# EAGLE schematic Node (EAGLE 9.1.3)
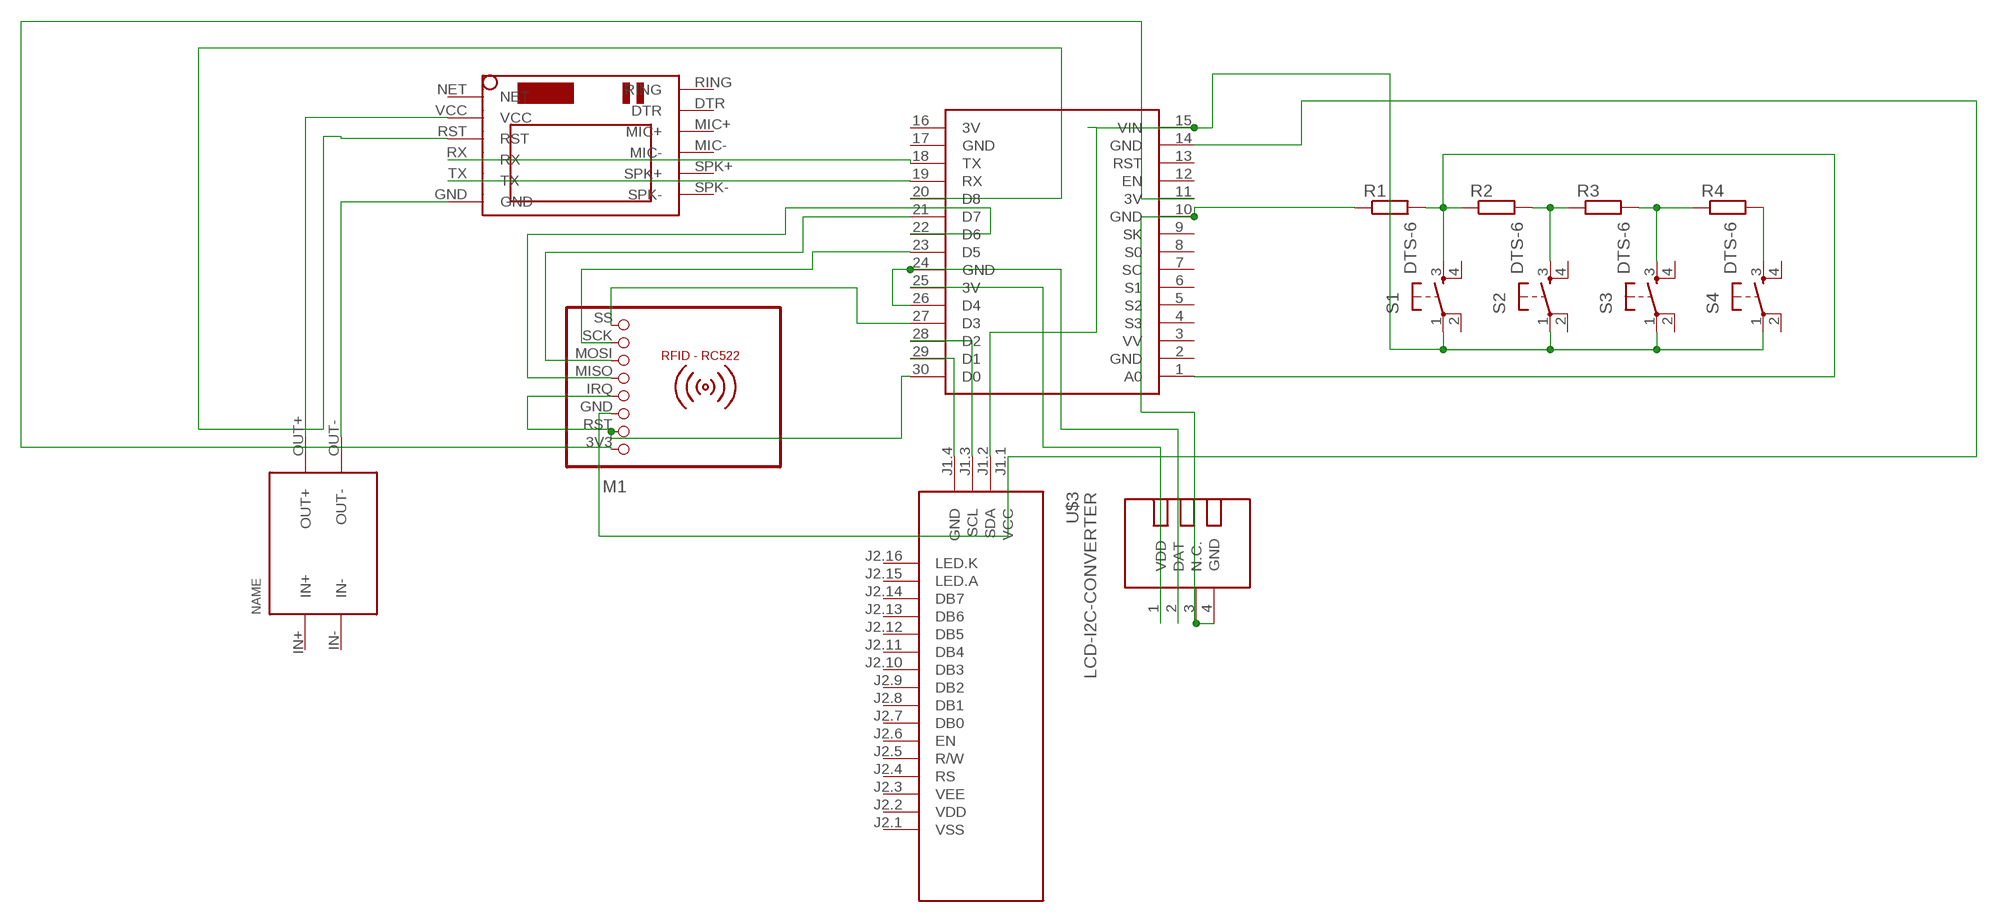
[diagram p0: schematic, sheet 1]

## Parts
M1  RFID-RC522  [RFID-RC522]
R1  R-EU_0817/22  [P0817/22]
R2  R-EU_0817/22  [P0817/22]
R3  R-EU_0817/22  [P0817/22]
R4  R-EU_0817/22  [P0817/22]
S1  DTS-6  [DTS-6]
S2  DTS-6  [DTS-6]
S3  DTS-6  [DTS-6]
S4  DTS-6  [DTS-6]
U$1  NODEMCU  [NODEMCU]
U$2  TEMP-HUM-SENSOR-DHT11  [TEMP-HUM-SENSOR-DHT11]
U$3  LCD-I2C-CONVERTER  [LCD-I2C-CONVERTER]
U$4  SIM800LMODULE  [SIM800LMODULE]
U$5  CP8-ADJ  [CP8-ADJ]

## Nets
N$1: U$4.GND U$5.OUT-
N$2: U$4.VCC U$5.OUT+
N$3: U$1.20(D8) U$4.RST
N$4: U$1.18(TX) U$4.RX
N$5: U$1.19(RX) U$4.TX
N$6: M1.MISO U$1.22(D6)
N$7: M1.MOSI U$1.21(D7)
N$8: M1.SCK U$1.23(D5)
N$9: U$1.25(3V) U$2.1(VDD)
N$10: M1.SS U$1.27(D3)
N$11: U$1.24(GND) U$1.26(D4) U$2.2(DAT)
N$12: U$1.29(D1) U$3.J1.4(GND)
N$13: U$1.28(D2) U$3.J1.3(SCL)
N$14: M1.GND U$1.14(GND) U$3.J1.1(VCC)
N$15: R1.1 U$1.10(GND) U$2.3(N.C.) U$2.4(GND)
N$16: M1.IRQ M1.RST U$1.30(D0)
N$17: M1.3V3 U$1.11(3V)
N$18: R1.2 R2.1 S1.3 U$1.1(A0)
N$21: R2.2 R3.1 S2.3
N$22: R3.2 R4.1 S3.3
N$23: R4.2 S4.3
N$24: S1.1 S2.1 S3.1 S4.1 U$1.15(VIN) U$3.J1.2(SDA)
Unconnected: S1.2 S1.4 S2.2 S2.4 S3.2 S3.4 S4.2 S4.4 U$1.3(VV) U$1.4(S3) U$1.5(S2) U$1.6(S1) U$1.7(SC) U$1.8(S0) U$1.9(SK) U$1.12(EN) U$1.13(RST) U$3.J2.1(VSS) U$3.J2.2(VDD) U$3.J2.3(VEE) U$3.J2.4(RS) U$3.J2.5(R/W) U$3.J2.6(EN) U$3.J2.7(DB0) U$3.J2.8(DB1) U$3.J2.9(DB2) U$3.J2.10(DB3) U$3.J2.11(DB4) U$3.J2.12(DB5) U$3.J2.13(DB6) U$3.J2.14(DB7) U$3.J2.15(LED.A) U$3.J2.16(LED.K) U$4.DTR U$4.MIC+ U$4.MIC- U$4.NET U$4.RING U$4.SPK+ U$4.SPK- U$5.IN+ U$5.IN-

## Power pins joined to a net without a drawn wire
3V: U$1.16(3V)
GND: U$1.2(GND) U$1.17(GND)

## Library data of the parts
M1 = mfrc522-module:RFID-RC522: RFID-RC522 MFRC-522 based breakout board
R1-R4 = rcl:R-EU_: RESISTOR, European symbol; SPICEPREFIX: R
S1-S4 = switch-tact:DTS-6
U$1 = nodemcu:NODEMCU
U$2 = diy-modules(1):TEMP-HUM-SENSOR-DHT11: DHT11 - digital humidity & temperature sensor DHT11 datasheet available here: https://akizukidenshi.com/download/ds/aosong/DHT11.pdf Click here to find device on ebay.com <http://www.ebay.com/sch/dht11+digital+sensor>
U$3 = diy-modules(1):LCD-I2C-CONVERTER: I2C Bus to 4-Bit Parallel LCD Interface with LED backlight driver
U$4 = SIM800LMODULE:SIM800LMODULE: SIM800L Module
U$5 = userlib:CP8-ADJ: Voltage regulator IN: 7-35V OUT: ADJ